# Altium project Longboard_32bit.PrjPCB (part 3 of 6)

## Sheet Misc_switches.SchDoc: RP2040 CNC
size B; Author: AM; CompanyName: Expatria Technologies; DrawnBy: A.Marles; Engineer: AM; Organization: Expatria Technolgoies; Address1: PO Box 2084; Address3: Merritt, BC V1K 1B8; Address4: Canada; DocumentNumber: 20; Revision: B6; SheetNumber: 17; SheetTotal: 26
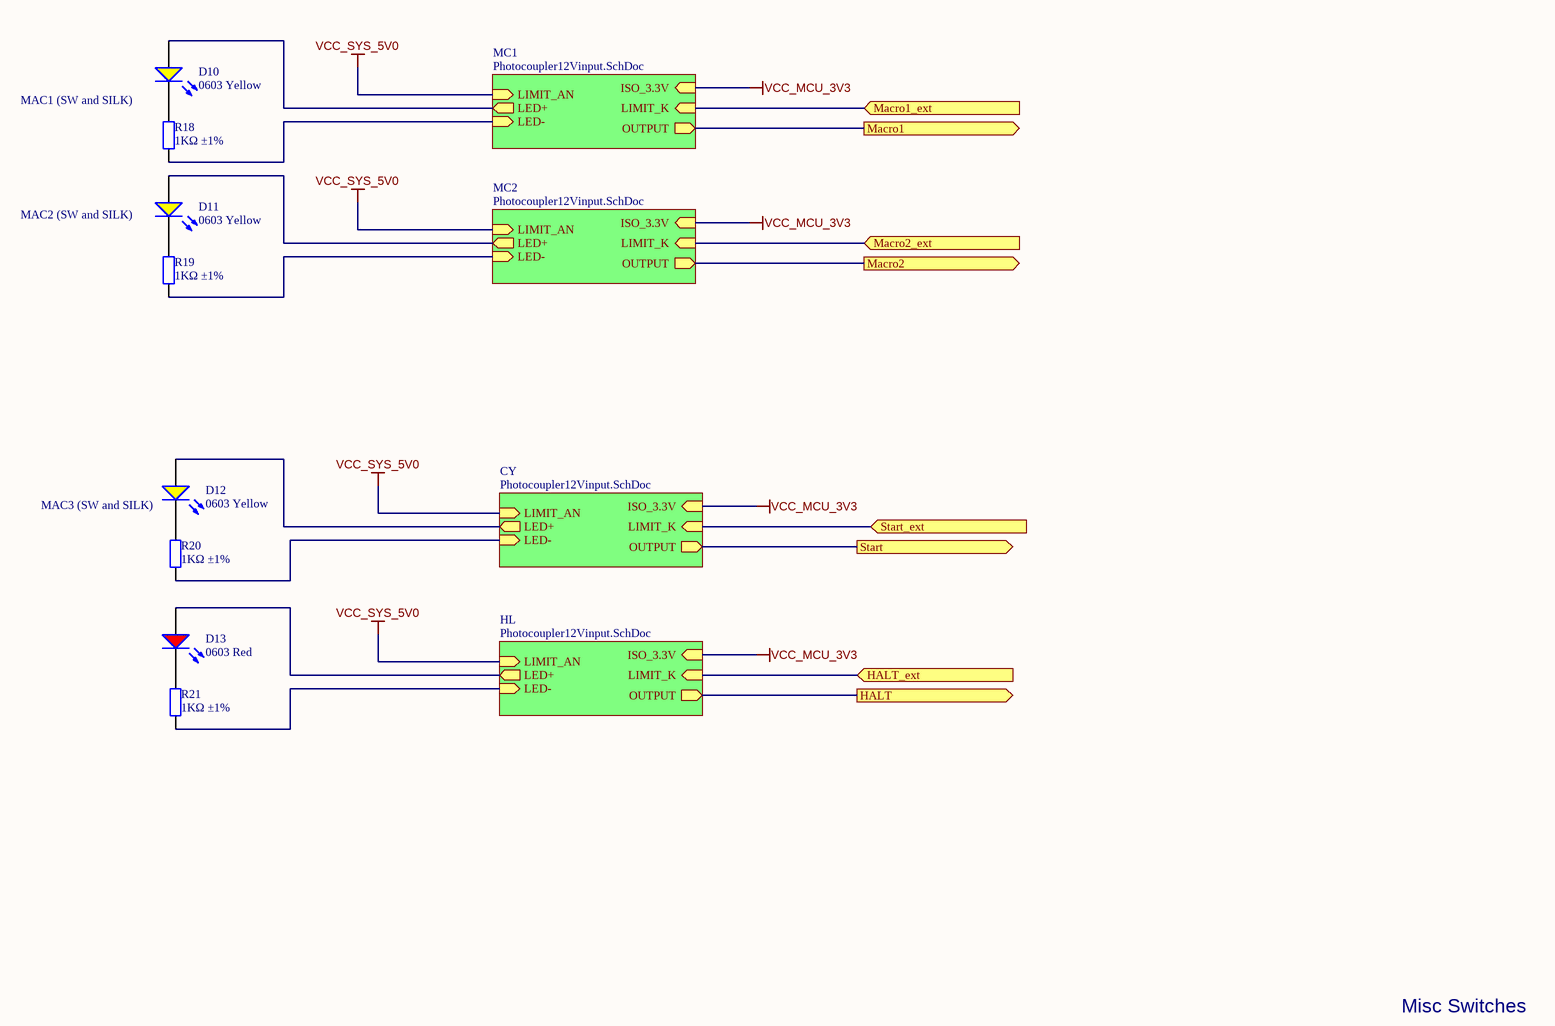
[diagram p8: Misc_switches.SchDoc]

### Parts
D10  0603 Yellow  [0603_LED_S1 - YELLOW]
D11  0603 Yellow  [0603_LED_S1 - YELLOW]
D12  0603 Yellow  [0603_LED_S1 - YELLOW]
D13  0603 Red  [0603_LED_S1]
R18  1KΩ ±1%  [0402_R]
R19  1KΩ ±1%  [0402_R]
R20  1KΩ ±1%  [0402_R]
R21  1KΩ ±1%  [0402_R]

### Sub-sheets
CY = Photocoupler12Vinput.SchDoc: OUTPUT (out), LED- (in), LED+ (out), ISO_3.3V (in), LIMIT_AN (in), LIMIT_K (in)
HL = Photocoupler12Vinput.SchDoc: OUTPUT (out), LED+ (out), LED- (in), ISO_3.3V (in), LIMIT_AN (in), LIMIT_K (in)
MC1 = Photocoupler12Vinput.SchDoc: OUTPUT (out), LED+ (out), LED- (in), ISO_3.3V (in), LIMIT_AN (in), LIMIT_K (in)
MC2 = Photocoupler12Vinput.SchDoc: OUTPUT (out), LED+ (out), LED- (in), ISO_3.3V (in), LIMIT_AN (in), LIMIT_K (in)

### Ports
HALT (out), HALT_ext (in), Macro1 (out), Macro1_ext (in), Macro2 (out), Macro2_ext (in), Start (out), Start_ext (in)

### Nets
VCC_MCU_3V3: D10.A D11.A D12.A D13.A ; sheet CY/LED+, sheet CY/ISO_3.3V, sheet MC1/LED+, sheet MC1/ISO_3.3V, sheet HL/LED+, sheet HL/ISO_3.3V, sheet MC2/LED+, sheet MC2/ISO_3.3V
VCC_SYS_5V0: sheet CY/LIMIT_AN, sheet MC1/LIMIT_AN, sheet HL/LIMIT_AN, sheet MC2/LIMIT_AN
CYC/ST: R20.2 ; port Start, sheet CY/OUTPUT, sheet CY/LED-
HALT: R21.2 ; port HALT, sheet HL/OUTPUT, sheet HL/LED-
HALT_ext: port HALT_ext, sheet HL/LIMIT_K
MAC1: R18.2 ; port Macro1, sheet MC1/OUTPUT, sheet MC1/LED-
MAC2: R19.2 ; port Macro2, sheet MC2/OUTPUT, sheet MC2/LED-
Macro1_ext: port Macro1_ext, sheet MC1/LIMIT_K
Macro2_ext: port Macro2_ext, sheet MC2/LIMIT_K
Start_ext: port Start_ext, sheet CY/LIMIT_K
NetD10_K: D10.K R18.1
NetD11_K: D11.K R19.1
NetD12_K: D12.K R20.1
NetD13_K: D13.K R21.1

### Notes on the sheet
- MAC1 (SW and SILK)
- MAC2 (SW and SILK)
- MAC3 (SW and SILK)
- Misc Switches
- SHEET
- Expatria Technologies
- 625 Kane Valley Rd.
- Box 2084
- Merritt, BC V1K1B8
- PROJECT
- SIZE
- ENGR
- MODIFIED
- DOCUMENT
- REV
- Copyright Sienci Labs 2024. This document describes Open Hardware and is licensed under the CERN-OHL-S v2. No warranty is implied or expressed.
- EMAIL: INFO@EXPATRIA.CA
- B
- /

### Library data of the parts
D10-D12 = 0603 LED Yellow: LED; ComponentLink1Description: 供应商链接; ComponentLink1URL: http://www.szlcsc.com/product/details_73147.html; Package: 0603; Supplier: LC; SuppliersPartNumber: C72038; Color: Yellow
D13 = 19-213SURC/S530-A3/TR8: 20mA 632nm Colorless transparence 624nm~624nm -40℃~+85℃ Red 120° 60mW 0603 Light Emitting Diodes (LED) ROHS; Manufacturer: Everlight Elec; ComponentLink1Description: 供应商链接; ComponentLink1URL: http://www.szlcsc.com/product/details_2659.html; Package: 0603; Supplier: LC; SuppliersPartNumber: C72039; Color: Red; Supplier 1: LC; Supplier Part Number 1: C72039; Manufacturer Part Number: 19-213SURC/S530-A3/TR8
R18-R21 = 0402 1K (1001) 1%: Chip resistor; Manufacturer: Uniroyal Elec; PartNumber: 0402WGF1001TCE; Power: 1/16W; ComponentLink1Description: Supplier link; ComponentLink1URL: http://www.szlcsc.com/product/details_12256.html; Package: 0402; Supplier: LC; SuppliersPartNumber: C11702; Resistance: 1KΩ; Tolerance: 1%; Manufacturer Part Number: 0402WGF1001TCE

## Sheet Spindle_Control.SchDoc: STM32F446 CNC
size B; Author: AM; CompanyName: Expatria Technologies; DrawnBy: A.Marles; Engineer: AM; Organization: Expatria Technolgoies; Address1: PO Box 2084; Address3: Merritt, BC V1K 1B8; Address4: Canada; DocumentNumber: 25; Revision: B6; SheetNumber: 22; SheetTotal: 26
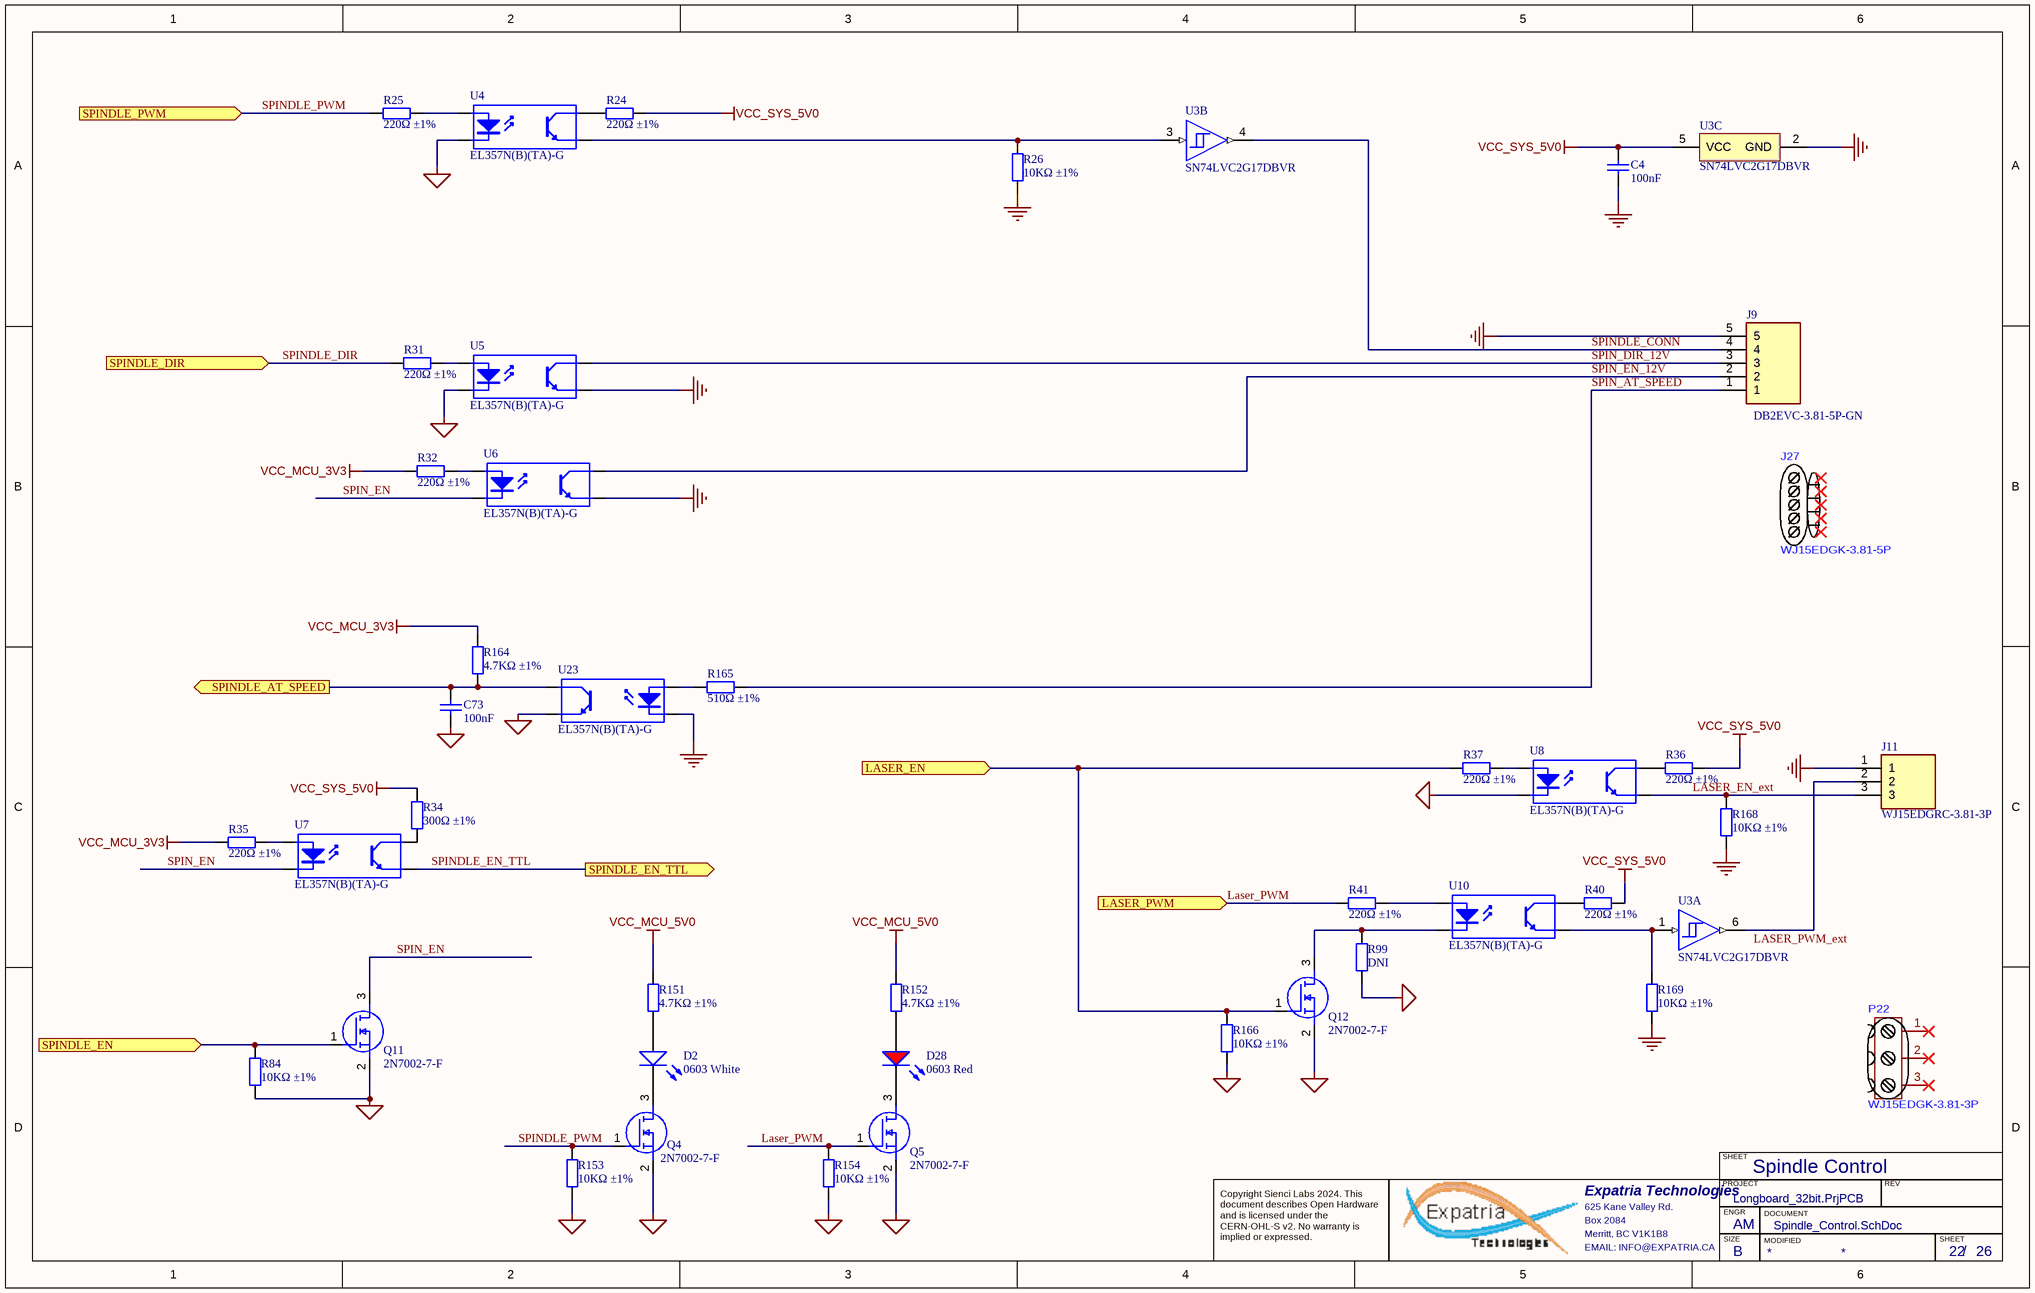
[diagram p9: Spindle_Control.SchDoc]

### Parts
C4  100nF  [0603_C]
C73  100nF  [0402_C]
D2  0603 White  [0603_LED_S1 - white]
D28  0603 Red  [0603_LED_S1]
J9  DB2EVC-3.81-5P-GN  [CONN-TH_5P-P3.81_DB2EVC-3.81-5P]
J11  WJ15EDGRC-3.81-3P  [SHDRRA3W85P0X381_1X3_1231X915X720P]
J27  WJ15EDGK-3.81-5P  (mechanical)
P22  WJ15EDGK-3.81-3P  (mechanical)
Q4  2N7002-7-F  [SOT-23(SOT-23-3)]
Q5  2N7002-7-F  [SOT-23(SOT-23-3)]
Q11  2N7002-7-F  [SOT-23(SOT-23-3)]
Q12  2N7002-7-F  [SOT-23(SOT-23-3)]
R24  220Ω ±1%  [0402_R]
R25  220Ω ±1%  [0402_R]
R26  10KΩ ±1%  [0402_R]
R31  220Ω ±1%  [0402_R]
R32  220Ω ±1%  [0402_R]
R34  300Ω ±1%  [0603_R]
R35  220Ω ±1%  [0402_R]
R36  220Ω ±1%  [0402_R]
R37  220Ω ±1%  [0402_R]
R40  220Ω ±1%  [0402_R]
R41  220Ω ±1%  [0402_R]
R84  10KΩ ±1%  [0402_R]
R99  DNI  [0603_R]
R151  4.7KΩ ±1%  [0402_R]
R152  4.7KΩ ±1%  [0402_R]
R153  10KΩ ±1%  [0402_R]
R154  10KΩ ±1%  [0402_R]
R164  4.7KΩ ±1%  [0402_R]
R165  510Ω ±1%  [0402_R]
R166  10KΩ ±1%  [0402_R]
R168  10KΩ ±1%  [0402_R]
R169  10KΩ ±1%  [0402_R]
U3  SN74LVC2G17DBVR  [DBV0006A_N]  (parts A,B,C of 3)
U4  EL357N(B)(TA)-G  [SOP-4_P2.54]
U5  EL357N(B)(TA)-G  [SOP-4_P2.54]
U6  EL357N(B)(TA)-G  [SOP-4_P2.54]
U7  EL357N(B)(TA)-G  [SOP-4_P2.54]
U8  EL357N(B)(TA)-G  [SOP-4_P2.54]
U10  EL357N(B)(TA)-G  [SOP-4_P2.54]
U23  EL357N(B)(TA)-G  [SOP-4_P2.54]

### Ports
LASER_EN (in), LASER_PWM (in), SPINDLE_AT_SPEED (out), SPINDLE_DIR (in), SPINDLE_EN (in), SPINDLE_EN_TTL (out), SPINDLE_PWM (in)

### Nets
GND: C4.1 J9.5 J11.1 R26.1 R168.1 R169.1 U3.2(GND) U5.3(E) U6.3(E) U23.2(K)
MCU_GND: C73.1 Q4.2(S) Q5.2(S) Q11.2(S) Q12.2(S) R84.1 R99.2 R153.1 R154.1 R166.1 U4.2(K) U5.2(K) U8.2(K) U23.3(E)
VCC_MCU_3V3: R32.1 R35.1 R164.1
VCC_MCU_5V0: R151.2 R152.2
VCC_SYS_5V0: C4.2 R24.2 R34.1 R36.2 R40.1 U3.5(VCC)
LASER_EN: Q12.1(G) R37.1 R166.2 ; port LASER_EN
LASER_EN_ext: J11.3 R168.2 U8.3(E)
Laser_PWM: Q5.1(G) R41.1 R154.2 ; port LASER_PWM
LASER_PWM_ext: J11.2 U3.6(1Y)
SPIN_AT_SPEED: J9.1 R165.1
SPIN_DIR_12V: J9.3 U5.4(C)
SPIN_EN: Q11.3(D) U6.2(K) U7.2(K)
SPIN_EN_12V: J9.2 U6.4(C)
SPINDLE_AT_SPEED: C73.2 R164.2 U23.4(C) ; port SPINDLE_AT_SPEED
SPINDLE_CONN: J9.4 U3.4(2Y)
SPINDLE_DIR: R31.1 ; port SPINDLE_DIR
SPINDLE_EN: Q11.1(G) R84.2 ; port SPINDLE_EN
SPINDLE_EN_TTL: U7.3(E) ; port SPINDLE_EN_TTL  [project net SPINDLE_EN_5V]
SPINDLE_PWM: Q4.1(G) R25.1 R153.2 ; port SPINDLE_PWM
NetD2_A: D2.A R151.1
NetD2_K: D2.K Q4.3(D)
NetD28_A: D28.A R152.1
NetD28_K: D28.K Q5.3(D)
NetQ12_3: Q12.3(D) R99.1 U10.2(K)
NetR24_1: R24.1 U4.4(C)
NetR25_2: R25.2 U4.1(A)
NetR26_2: R26.2 U3.3(2A) U4.3(E)
NetR31_2: R31.2 U5.1(A)
NetR32_2: R32.2 U6.1(A)
NetR34_2: R34.2 U7.4(C)
NetR35_2: R35.2 U7.1(A)
NetR36_1: R36.1 U8.4(C)
NetR37_2: R37.2 U8.1(A)
NetR40_2: R40.2 U10.4(C)
NetR41_2: R41.2 U10.1(A)
NetR165_2: R165.2 U23.1(A)
NetR169_2: R169.2 U3.1(1A) U10.3(E)

Not connected (* = marked no-connect by the designer): P22 1* 2* 3*

### Notes on the sheet
- Spindle Control
- SHEET
- Expatria Technologies
- 625 Kane Valley Rd.
- Box 2084
- Merritt, BC V1K1B8
- PROJECT
- SIZE
- ENGR
- MODIFIED
- DOCUMENT
- REV
- Copyright Sienci Labs 2024. This document describes Open Hardware and is licensed under the CERN-OHL-S v2. No warranty is implied or expressed.
- EMAIL: INFO@EXPATRIA.CA
- B
- /

### Library data of the parts
C4 = 0603 100nF (104) 10% 50V: 50V 100nF X7R ±10% 0603 Multilayer Ceramic Capacitors MLCC - SMD/SMT ROHS; Manufacturer: YAGEO; Manufacturer Part Number: CC0603KRX7R9BB104; ComponentLink1Description: Supplier link; ComponentLink1URL: http://www.szlcsc.com/product/details_15331.html; Package: 0603; Supplier: LC; SuppliersPartNumber: C14663; Capacitance: 100nF; Tolerance: 10%; Voltage: 50V
C73 = 0402 100nF (104) 10% 16V: 16V 100nF X7R ±10% 0402 Multilayer Ceramic Capacitors MLCC - SMD/SMT ROHS; Manufacturer: Samsung Electro-Mechanics; Manufacturer Part Number: CL05B104KO5NNNC; ComponentLink1Description: Supplier link; ComponentLink1URL: http://www.szlcsc.com/product/details_1877.html; Package: 0402; Supplier: LC; SuppliersPartNumber: C1525; Capacitance: 100nF; Tolerance: 10%; Voltage: 16V
D2 = 19-217UWD/S365-2/TR8: LED; Manufacturer: Everlight Elec; Package: 0603; Supplier: LC; SuppliersPartNumber: C133759; Color: White; Manufacturer Part Number: 19-217UWD/S365-2/TR8
D28 = 19-213SURC/S530-A3/TR8: as D13 on sheet Misc_switches; Package: 0603; Supplier: LC; SuppliersPartNumber: C72039; Color: Red; ComponentLink1Description: 供应商链接; ComponentLink1URL: http://www.szlcsc.com/product/details_2659.html; Supplier 1: LC; Supplier Part Number 1: C72039; Manufacturer Part Number: 19-213SURC/S530-A3/TR8
J9 = DB2EVC-3.81-5P-GN: 3.81mm Green Board Edge/Receptacle-Close Push-Pull,P=3.81mm Pluggable System Terminal Block ROHS; Manufacturer: DIBO; SuppliersPartNumber: C395701; Manufacturer Part Number: DB2EVC-3.81-5P-GN; Supplier: LCSC; Value: DB2EVC-3.81-5P-GN
J11 = WJ15EDGRC-3.81-3P: 3.81mm Green Board Edge/Receptacle-Close Push-Pull,P=3.81mm Pluggable System Terminal Block ROHS; Manufacturer: Ningbo Kangnex; SuppliersPartNumber: C8406; Datasheet Link: https://datasheet.lcsc.com/szlcsc/1912251633_Ningbo-Kangnex-Elec-WJ15EDGRC-3-81-3P_C8406.pdf; Height: 7.2mm; Manufacturer Part Number: WJ15EDGRC-3.81-3P
J27 = WJ15EDGK-3.81-5P: 3.81mm Green Plug P=3.81mm Pluggable System Terminal Block ROHS; Manufacturer: Ningbo Kangnex Elec; SuppliersPartNumber: C3804; Manufacturer Part Number: WJ15EDGK-3.81-5P; Supplier: LCSC
P22 = WJ15EDGK-3.81-3P: 3.81mm Green Plug P=3.81mm Pluggable System Terminal Block ROHS; Manufacturer: Ningbo; Value: WJ15EDGK-3.81-3P; SuppliersPartNumber: C8413; Supplier: LCSC; Manufacturer Part Number: WJ15EDGK-3.81-3P
Q4 Q5 Q11 Q12 = 2N7002-7-F: 60V 115mA 7.5Ω@5V,50mA 370mW N Channel SOT-23 MOSFETs ROHS; Manufacturer: Diodes Inc.; SuppliersPartNumber: C85049; Manufacturer Part Number: 2N7002-7-F; Value: 2N7002-7-F; Datasheet Link: https://datasheet.datasheetarchive.com/originals/distributors/SFDatasheet-0/sf-0003625.pdf; Height: 1.2mm; Manufacturer_Part_Number: 2N7002-7-F; Mouser Part Number: 621-2N7002-F; Mouser Price/Stock: https://www.mouser.co.uk/ProductDetail/Diodes-Incorporated/2N7002-7-F?qs=jMXWnm70%252BC%252BAX%252BMLzUkTZg%3D%3D; Arrow Part Number: 2N7002-7-F; Arrow Price/Stock: https://www.arrow.com/en/products/2n7002-7-f/diodes-incorporated?region=nac
R24 R25 R31 R32 R35-R37 R40 R41 = 0402 220R (2200) 1%: Chip resistor; Manufacturer: Uniroyal Elec; Manufacturer Part Number: 0402WGF2200TCE; Power: 1/16W; ComponentLink1Description: Supplier link; ComponentLink1URL: http://www.szlcsc.com/product/details_25834.html; Package: 0402; Supplier: LC; SuppliersPartNumber: C25091; Resistance: 220Ω; Tolerance: 1%
R26 R84 R153 R154 R166 R168 R169 = 0402 10K (1002) 1%: Chip resistor; Manufacturer: Uniroyal Elec; Manufacturer Part Number: 0402WGF1002TCE; Power: 1/16W; Package: 0402; Supplier: LC; SuppliersPartNumber: C25744; Resistance: 10KΩ; Tolerance: 1%; ComponentLink1Description: Supplier link; ComponentLink1URL: http://www.szlcsc.com/product/details_26487.html
R34 = 0603 300R (3000) 1%: Chip resistor; Manufacturer: Uniroyal Elec; Manufacturer Part Number: 0603WAF3000T5E; Power: 1/10W; Package: 0603; Supplier: LCSC; SuppliersPartNumber: C23025; Resistance: 300Ω; Tolerance: 1%; ComponentLink1Description: Supplier link; ComponentLink1URL: http://www.szlcsc.com/product/details_23752.html
R99 = 0603 0R (0R0) 1%: Chip resistor; Manufacturer: Uniroyal Elec; Manufacturer Part Number: 0603WAF0000T5E; Power: 1/10W; Resistance: 0Ω; Tolerance: 1%; ComponentLink1Description: Supplier link; ComponentLink1URL: http://www.szlcsc.com/product/details_21903.html; Package: 0603; Supplier: LC; SuppliersPartNumber: C21189
R151 R152 = 0402 4.7K (4701) 1%: Chip resistor; Manufacturer: Uniroyal Elec; Manufacturer Part Number: 0402WGF4701TCE; Power: 1/16W; ComponentLink1Description: Supplier link; ComponentLink1URL: http://www.szlcsc.com/product/details_26643.html; Package: 0402; Supplier: LCSC; SuppliersPartNumber: C25900; Resistance: 4.7KΩ; Tolerance: 1%
R164 = 0402 4.7K (4701) 1%: Chip resistor; Manufacturer: Uniroyal Elec; PartNumber: 0402WGF4701TCE; Power: 1/16W; Package: 0402; Supplier: LC; SuppliersPartNumber: C25900; Resistance: 4.7KΩ; Tolerance: 1%; ComponentLink1Description: Supplier link; ComponentLink1URL: http://www.szlcsc.com/product/details_26643.html
R165 = 0402 510R (5100) 1%: Chip resistor; Manufacturer: Uniroyal Elec; Manufacturer Part Number: 0402WGF5100TCE; Power: 1/16W; ComponentLink1Description: Supplier link; ComponentLink1URL: http://www.szlcsc.com/product/details_25866.html; Package: 0402; Supplier: LC; SuppliersPartNumber: C25123; Resistance: 510Ω; Tolerance: 1%
U3 = CMP-0859-00225-4: Dual Schmitt-Trigger Buffer, DBV0006A, LARGE T&R; Manufacturer: Texas Instruments; F @ Nom Voltage(Max)(Mhz): 150; VCC(Max)(V): 5.5; tpd @ Nom Voltage(Max)(ns): 9.3,5.7,5.4,4.3; Sub-Family: Non-Inverting Buffer/Driver; Output Drive (IOL/IOH)(Max)(mA): 32/-32; Output Type: CMOS; Voltage(Nom)(V): 1.8,2.5,3.3,5; ICC @ Nom Voltage(Max)(mA): 0.01; Schmitt Trigger: Yes; Technology Family: LVC; VCC(Min)(V): 1.65; 3-State Output: No; Rating: Catalog; Bits(#): 2; Input Type: CMOS/TTL; Logic: True; DatasheetVersion: SCES381N; Generic Part Number: SN74LVC2G17; PackageReference: DBV0006A; Operating Temperature Range(C): -40 to 125,-40 to 85; SuppliersPartNumber: C10429; Value: SN74LVC2G17DBVR; Manufacturer Part Number: SN74LVC2G17DBVR
U4-U8 U10 U23 = EL357N(B)(TA)-G_[C6649]: 80V 3750V 50mA 0.1V@1mA,20mA 1 6V 1.2V DC SOP-4-2.54mm Optocouplers - Phototransistor Output ROHS; Manufacturer 1: Everlight Elec; Package: SOP-4_P2.54; Supplier: LCSC; SuppliersPartNumber: C6649; Manufacturer Part Number 1: EL357N(B)(TA)-G; Manufacturer: Everlight Elec; Manufacturer Part Number: EL357N(B)(TA)-G
  U7 U8 U10 U23: ComponentLink1Description: 供应商链接; ComponentLink1URL: http://www.szlcsc.com/product/details_7114.html

## Sheet RS485.SchDoc: RP2040 CNC
size B; Author: AM; CompanyName: Expatria Technologies; DrawnBy: A.Marles; Engineer: AM; Organization: Expatria Technolgoies; Address1: PO Box 2084; Address3: Merritt, BC V1K 1B8; Address4: Canada; DocumentNumber: 29; Revision: B6; SheetNumber: 25; SheetTotal: 26
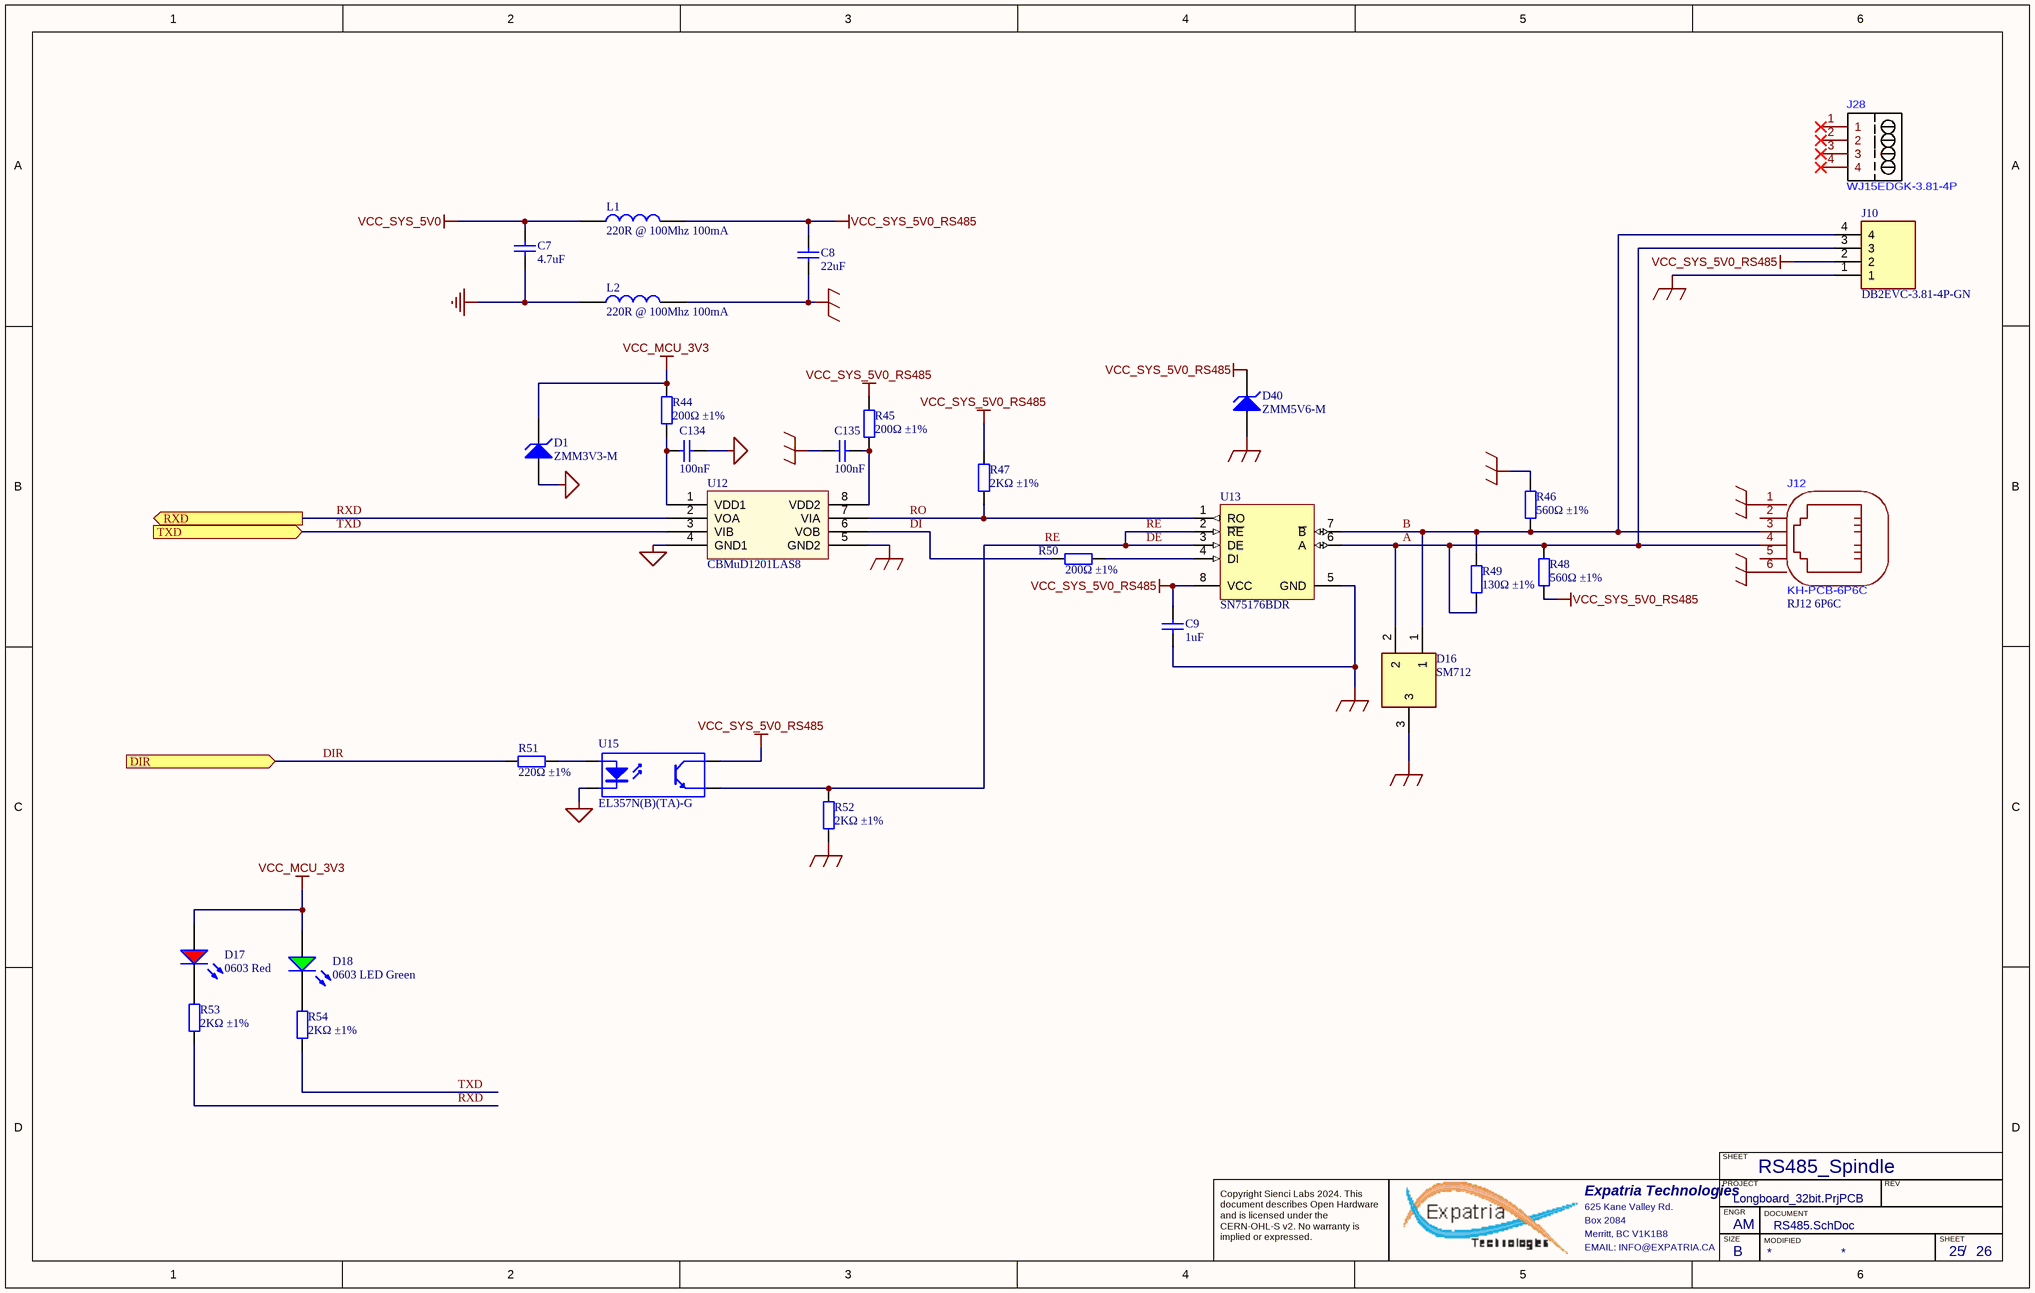
[diagram p10: RS485.SchDoc]

### Parts
C7  4.7uF  [0805_C]
C8  22uF  [0805_C]
C9  1uF  [0603_C]
C134  100nF  [0402_C]
C135  100nF  [0402_C]
D1  ZMM3V3-M  [LL-34]
D16  SM712  [SOT95P230X117-3N]
D17  0603 Red  [0603_LED_S1]
D18  0603 LED Green  [0603_LED_S1 - GREEN]
D40  ZMM5V6-M  [LL-34]
J10  DB2EVC-3.81-4P-GN  [CONN-TH_5P-P3.81_DB2EVC-3.81-4p]
J12  KH-PCB-6P6C  value RJ12 6P6C  [RJ11-TH_DS1133-S60BPX]
J28  WJ15EDGK-3.81-4P  (mechanical)
L1  220R @ 100Mhz 100mA  [0402_L]
L2  220R @ 100Mhz 100mA  [0402_L]
R44  200Ω ±1%  [0402_R]
R45  200Ω ±1%  [0402_R]
R46  560Ω ±1%  [0603_R]
R47  2KΩ ±1%  [0603_R]
R48  560Ω ±1%  [0603_R]
R49  130Ω ±1%  [0603_R]
R50  200Ω ±1%  [0402_R]
R51  220Ω ±1%  [0402_R]
R52  2KΩ ±1%  [0603_R]
R53  2KΩ ±1%  [0603_R]
R54  2KΩ ±1%  [0603_R]
U12  CBMuD1201LAS8  [SOIC-8_150mil]
U13  SN75176BDR  [SOIC-8_150mil]
U15  EL357N(B)(TA)-G  [SOP-4_P2.54]

### Ports
DIR (in), RXD (out), TXD (in)

### Nets
GND: C7.1 L2.1
MCU_GND: C134.2 D1.1(A) U12.4(GND1) U15.2(K)
MOD_GND: C8.1 C9.1 C135.1 D16.3 D40.1(A) J10.1 J12.1(MCLR) J12.6(NC) L2.2 R46.1 R52.1 U12.5(GND2) U13.5(GND)
VCC_MCU_3V3: D1.2(K) D17.A D18.A R44.2
VCC_SYS_5V0: C7.2 L1.1
VCC_SYS_5V0_RS485: C8.2 C9.2 D40.2(K) J10.2 L1.2 R45.2 R47.2 R48.2 U13.8(VCC) U15.4(C)
A: D16.2 J10.3 J12.4(PGD) R48.1 R49.1 U13.6(A)
B: D16.1 J10.4 J12.3(VSS) R46.2 R49.2 U13.7(~{B})
DE: R52.2 U13.2(~{RE}) U13.3(DE) U15.3(E)  [also labelled RE]
DI: R50.2 U12.6(VOB)
DIR: R51.2 ; port DIR
RO: R47.1 U12.7(VIA) U13.1(RO)
RXD: R53.1 U12.2(VOA) ; port RXD
TXD: R54.1 U12.3(VIB) ; port TXD
NetC134_1: C134.1 R44.1 U12.1(VDD1)
NetC135_2: C135.2 R45.1 U12.8(VDD2)
NetD17_K: D17.K R53.2
NetD18_K: D18.K R54.2
NetR50_1: R50.1 U13.4(DI)
NetR51_1: R51.1 U15.1(A)

Not connected (* = marked no-connect by the designer): J12 2(VDD) 5(PGC); J28 1* 2* 3* 4*

### Notes on the sheet
- RS485_Spindle
- SHEET
- Expatria Technologies
- 625 Kane Valley Rd.
- Box 2084
- Merritt, BC V1K1B8
- PROJECT
- SIZE
- ENGR
- MODIFIED
- DOCUMENT
- REV
- Copyright Sienci Labs 2024. This document describes Open Hardware and is licensed under the CERN-OHL-S v2. No warranty is implied or expressed.
- EMAIL: INFO@EXPATRIA.CA
- B
- /

### Library data of the parts
C7 = 0805 4.7uF (475) 10% 25V: Chip capacitors; Manufacturer: Samsung Electro-Mechanics; Manufacturer Part Number: CL21A475KAQNNNE; Tolerance: 10%; Voltage: 25V; ComponentLink1Description: Supplier link; ComponentLink1URL: http://www.szlcsc.com/product/details_2131.html; Package: 0805; Supplier: LCSC; SuppliersPartNumber: C1779; Capacitance: 4.7uF
C8 = 0805 22uF (226) 20% 25V: 25V 22uF X5R ±20% 0805 Multilayer Ceramic Capacitors MLCC - SMD/SMT ROHS; Manufacturer: Samsung Electro-Mechanics; Manufacturer Part Number: CL21A226MAQNNNE; ComponentLink1Description: Supplier link; ComponentLink1URL: http://www.szlcsc.com/product/details_46786.html; Package: 0805; Supplier: LC; SuppliersPartNumber: C45783; Capacitance: 22uF; Tolerance: 20%; Voltage: 25V
C9 = 0603 1uF (105) 10% 50V: Chip capacitors; Manufacturer: Samsung Electro-Mechanics; Manufacturer Part Number: CL10A105KB8NNNC; Tolerance: 10%; Voltage: 50V; ComponentLink1Description: Supplier link; ComponentLink1URL: http://www.szlcsc.com/product/details_16531.html; Package: 0603; Supplier: LCSC; SuppliersPartNumber: C15849; Capacitance: 1uF
C134 C135 = 0402 100nF (104) 10% 16V: as C73 on sheet Spindle_Control; ComponentLink1Description: Supplier link; ComponentLink1URL: http://www.szlcsc.com/product/details_1877.html; Package: 0402; Supplier: LC; SuppliersPartNumber: C1525; Capacitance: 100nF; Tolerance: 10%; Voltage: 16V
D1 = LL-34 ZMM3V3-M: Single 3.1V~3.5V 500mW 3.3V LL-34 Zener Diodes ROHS; Manufacturer: ST(Semtech); ComponentLink1Description: 供应商链接; ComponentLink1URL: http://www.szlcsc.com/product/details_8541.html; Package: LL-34; Supplier: LC; SuppliersPartNumber: C8056; Manufacturer Part Number: ZMM3V3-M
D16 = CDSOT23-SM712: Bidirectional 12V (Max), 7V (Max) 7.5V / 13.3V 10V / 20V 12A(8/20us) SOT-23-3 TVS RoHS; Manufacturer: DOWO; Height: 1.17mm; SuppliersPartNumber: C293966; Manufacturer Part Number: SM712; Supplier 1: LCSC; Supplier Part Number 1: C293966; Manufacturer 1: DOWO; Manufacturer Part Number 1: SM712; Package: SOT-23-3
D17 = 19-213SURC/S530-A3/TR8: as D13 on sheet Misc_switches; ComponentLink1Description: 供应商链接; ComponentLink1URL: http://www.szlcsc.com/product/details_2659.html; Package: 0603; Supplier: LC; SuppliersPartNumber: C72039; Color: Red; Supplier 1: LC; Supplier Part Number 1: C72039; Manufacturer Part Number: 19-213SURC/S530-A3/TR8
D18 = 19-217/GHC-YR1S2/3T: Colorless transparence -40℃~+85℃ 520nm~535nm Emerald 120° 110mW 0603 Light Emitting Diodes (LED) ROHS; Manufacturer: Everlight Elec; Package: 0603; Supplier: LC; SuppliersPartNumber: C72043; Color: Green; Manufacturer Part Number: 19-217/GHC-YR1S2/3T
D40 = LL-34 ZMM5V6-M: Single 5.2V~6V 500mW 5.6V LL-34 Zener Diodes ROHS; Manufacturer: ST(Semtech); ComponentLink1Description: 供应商链接; ComponentLink1URL: http://www.szlcsc.com/product/details_8541.html; Package: LL-34; Supplier: LC; SuppliersPartNumber: C8062; Manufacturer Part Number: ZMM5V6-M
J10 = DB2EVC-3.81-4P-GN: 3.81mm Green Board Edge/Receptacle-Close Push-Pull,P=3.81mm Pluggable System Terminal Block ROHS; Manufacturer: DIBO; SuppliersPartNumber: C395697; Manufacturer Part Number: DB2EVC-3.81-4P-GN; Supplier: LCSC; Value: DB2EVC-3.81-4P-GN
J12 = KH-PCB-6P6C: RJ45 RJReceptacle No 1 Shrouded Without LED -45℃~+85℃ Plugin Ethernet Connectors/Modular Connectors (RJ45 RJ11) ROHS; Manufacturer: Shenzhen Kinghelm Elec; Manufacturer Part Number: KH-PCB-6P6C; SuppliersPartNumber: C2683354; Supplier: LCSC
J28 = WJ15EDGK-3.81-4P: 3.81mm Green Plug P=3.81mm Pluggable System Terminal Block ROHS; Manufacturer: Ningbo; SuppliersPartNumber: C7244; Supplier: LCSC; Manufacturer Part Number: WJ15EDGK-3.81-4P; Value: WJ15EDGK-3.81-4P
L1 L2 = 0402 220R@100Mhz 0.1A: 700mΩ ±25% 220Ω@100MHz 0402 Ferrite Beads ROHS; Manufacturer Part Number: CBG100505U221T; Manufacturer: FH (Guangdong Fenghua Advanced Tech); Package: 0402; Supplier: LC; SuppliersPartNumber: C92617
R44 R45 R50 = 0402 200R (2000) 1%: Chip resistor; Manufacturer: Uniroyal Elec; Manufacturer Part Number: 0402WGF2000TCE; Power: 1/16W; ComponentLink1Description: Supplier link; ComponentLink1URL: http://www.szlcsc.com/product/details_25830.html; Package: 0402; Supplier: LC; SuppliersPartNumber: C25087; Resistance: 200Ω; Tolerance: 1%
R46 R48 = 0603 560R (5600) 1%: Chip resistor; Manufacturer: Uniroyal Elec; Manufacturer Part Number: 0603WAF5600T5E; Power: 1/10W; ComponentLink1Description: Supplier link; ComponentLink1URL: http://www.szlcsc.com/product/details_23931.html; Package: 0603; Supplier: LCSC; SuppliersPartNumber: C23204; Resistance: 560Ω; Tolerance: 1%
R47 R52-R54 = 0603 2K (2001) 1%: Chip resistor; Manufacturer: Uniroyal Elec; Manufacturer Part Number: 0603WAF2001T5E; Power: 1/10W; ComponentLink1Description: Supplier link; ComponentLink1URL: http://www.szlcsc.com/product/details_23702.html; Package: 0603; Supplier: LCSC; SuppliersPartNumber: C22975; Resistance: 2KΩ; Tolerance: 1%
R49 = 0603 130R (1300) 1%: Chip resistor; Manufacturer: Uniroyal Elec; Manufacturer Part Number: 0603WAF1300T5E; Power: 1/10W; ComponentLink1Description: Supplier link; ComponentLink1URL: http://www.szlcsc.com/product/details_23523.html; Package: 0603; Supplier: LCSC; SuppliersPartNumber: C22796; Resistance: 130Ω; Tolerance: 1%
R51 = 0402 220R (2200) 1%: as R24 on sheet Spindle_Control; Package: 0402; Supplier: LC; SuppliersPartNumber: C25091; Resistance: 220Ω; Tolerance: 1%; ComponentLink1Description: Supplier link; ComponentLink1URL: http://www.szlcsc.com/product/details_25834.html
U12 = CBMuD1201LAS8: Dual Channel Isolator; Manufacturer: Corebai Microelectronics; Package: SOIC-8_150mil; Supplier: LC; SuppliersPartNumber: C476472; ComponentLink1Description: 供应商链接; ComponentLink1URL: http://www.szlcsc.com/product/details_10199.html; Manufacturer Part Number: CBMuD1201LAS8
U13 = SN75176BDR_[C7063]: RS-485/RS-422; Manufacturer: Texas Instruments; ComponentLink1Description: 供应商链接; ComponentLink1URL: http://www.szlcsc.com/product/details_7535.html; Package: SOIC-8_150mil; Supplier: LCSC; SuppliersPartNumber: C7063; Manufacturer Part Number: SN75176BDR
U15 = EL357N(B)(TA)-G_[C6649]: 80V 3750V 50mA 0.1V@1mA,20mA 1 6V 1.2V DC SOP-4-2.54mm Optocouplers - Phototransistor Output ROHS; Manufacturer 1: Everlight; Manufacturer: Everlight Elec; Package: SOP-4_P2.54; Supplier: LCSC; SuppliersPartNumber: C6649; Manufacturer Part Number 1: EL357N(B)(TA)-G; Manufacturer Part Number: EL357N(B)(TA)-G

## Sheet Ethernet_Interface.SchDoc: STM32F446 CNC
size B; Author: AM; CompanyName: Expatria Technologies; DrawnBy: A.Marles; Engineer: AM; Organization: Expatria Technolgoies; Address1: PO Box 2084; Address3: Merritt, BC V1K 1B8; Address4: Canada; DocumentNumber: 7; Revision: B6; SheetNumber: 7; SheetTotal: 26
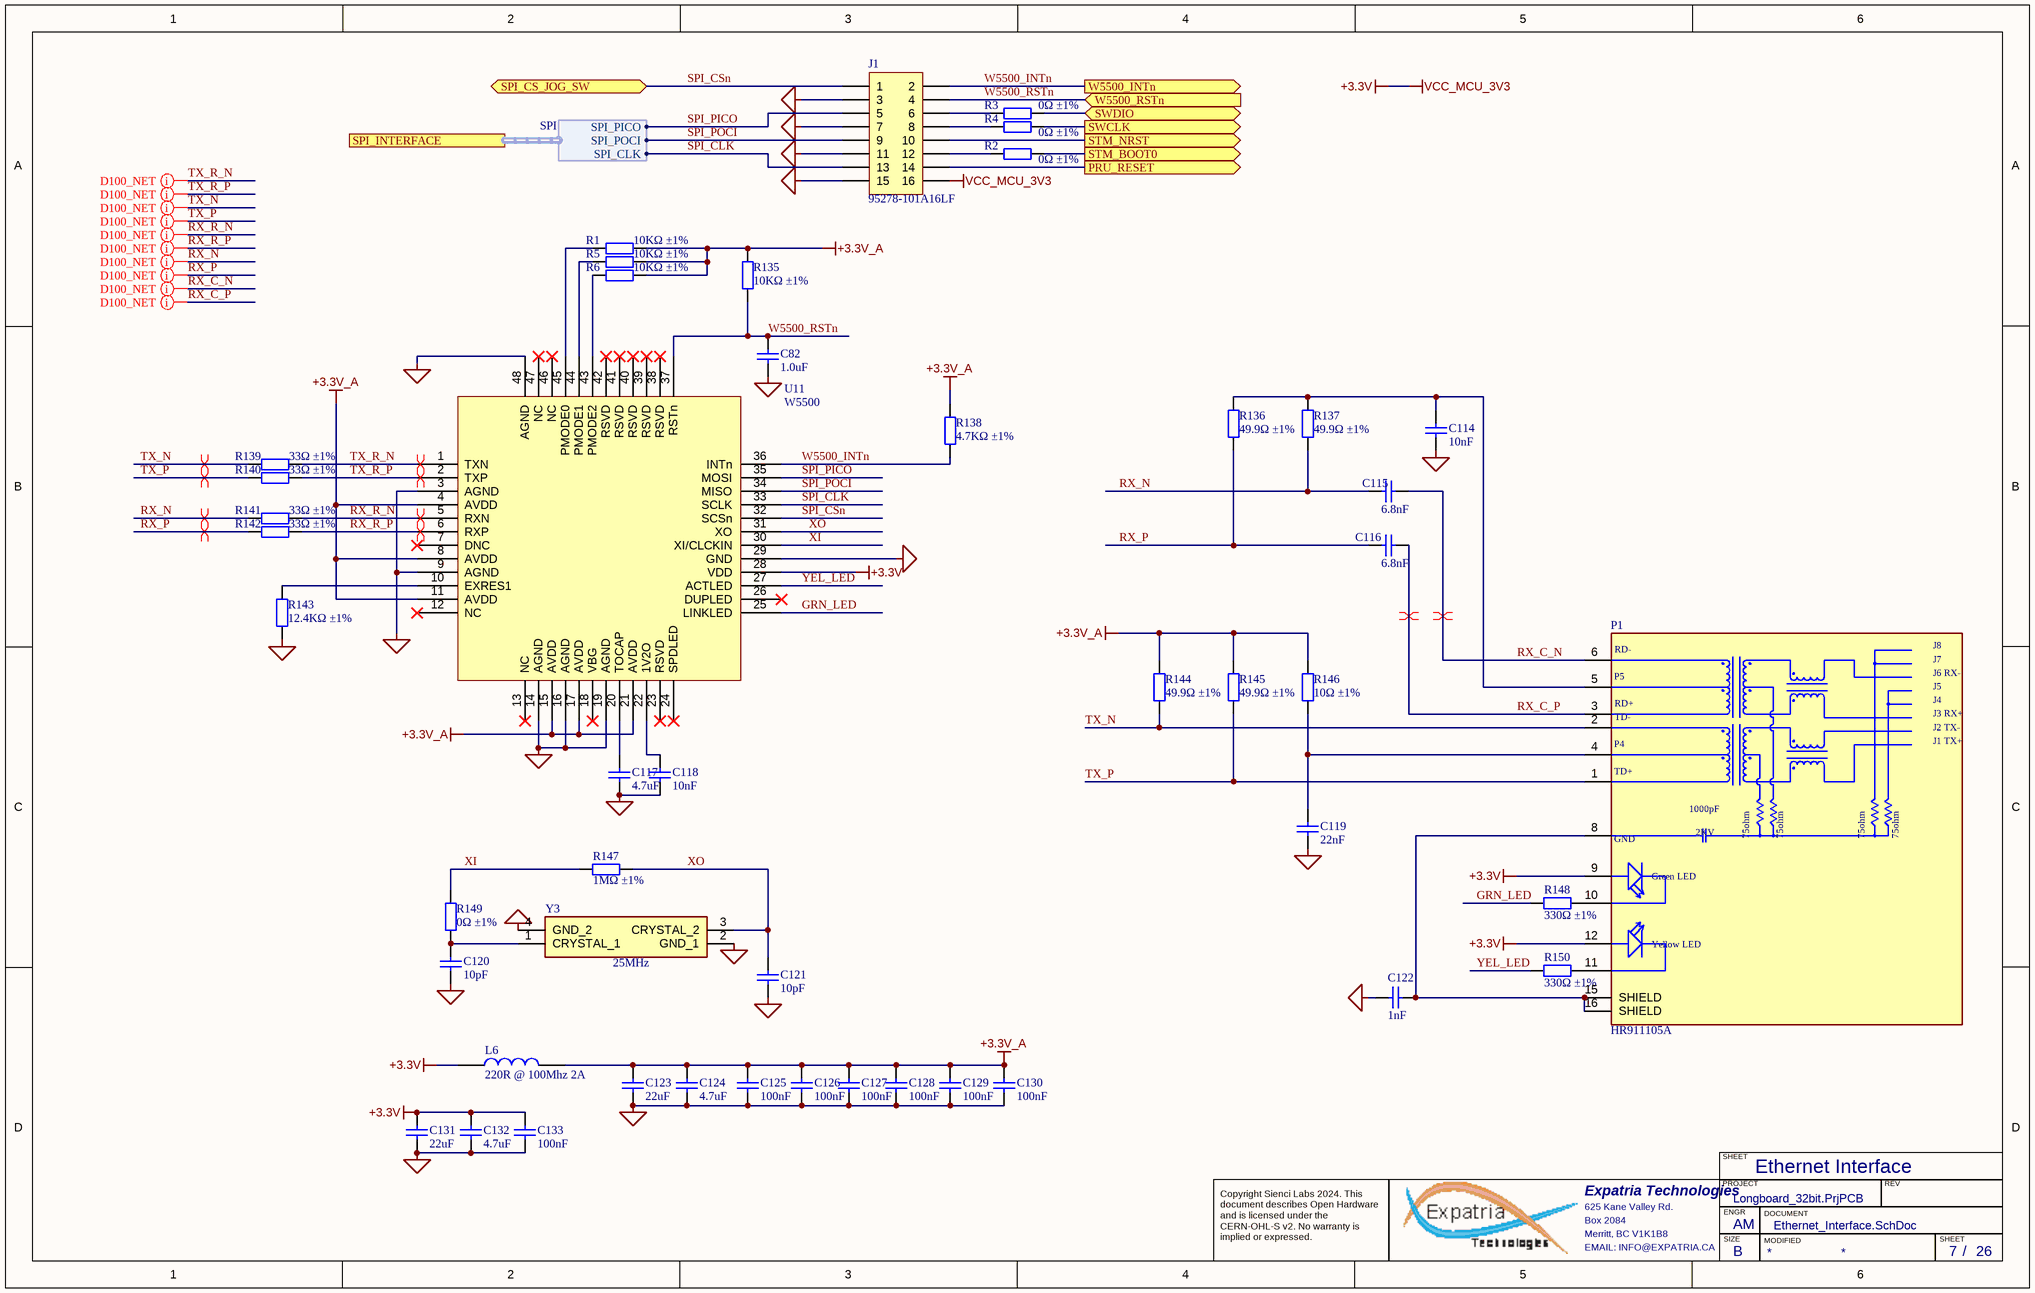
[diagram p11: Ethernet_Interface.SchDoc]

### Parts
C82  1.0uF  [0402_C]
C114  10nF  [0402_C]
C115  6.8nF  [0402_C]
C116  6.8nF  [0402_C]
C117  4.7uF  [0402_C]
C118  10nF  [0402_C]
C119  22nF  [0402_C]
C120  10pF  [0402_C]
C121  10pF  [0402_C]
C122  1nF  [1206_C]
C123  22uF  [0805_C]
C124  4.7uF  [0603_C]
C125  100nF  [0402_C]
C126  100nF  [0402_C]
C127  100nF  [0402_C]
C128  100nF  [0402_C]
C129  100nF  [0402_C]
C130  100nF  [0402_C]
C131  22uF  [0805_C]
C132  4.7uF  [0603_C]
C133  100nF  [0402_C]
J1  95278-101A16LF  [95278101A16LF]
L6  220R @ 100Mhz 2A  [0805_R]
P1  HR911105A  [HANRUN_HR911105A]
R1  10KΩ ±1%  [0402_R]
R2  0Ω ±1%  [0603_R]
R3  0Ω ±1%  [0603_R]
R4  0Ω ±1%  [0603_R]
R5  10KΩ ±1%  [0402_R]
R6  10KΩ ±1%  [0402_R]
R135  10KΩ ±1%  [0402_R]
R136  49.9Ω ±1%  [0402_R]
R137  49.9Ω ±1%  [0402_R]
R138  4.7KΩ ±1%  [0402_R]
R139  33Ω ±1%  [0402_R]
R140  33Ω ±1%  [0402_R]
R141  33Ω ±1%  [0402_R]
R142  33Ω ±1%  [0402_R]
R143  12.4KΩ ±1%  [0603_R]
R144  49.9Ω ±1%  [0402_R]
R145  49.9Ω ±1%  [0402_R]
R146  10Ω ±1%  [0402_R]
R147  1MΩ ±1%  [0402_R]
R148  330Ω ±1%  [0402_R]
R149  0Ω ±1%  [0402_R]
R150  330Ω ±1%  [0402_R]
U11  W5500  [LQFP-48_7x7x05P]
Y3  value 25MHz  [YSX321SL]  (hidden comment: X322525MSB4SI)

### Ports
PRU_RESET (out), SPI_CS_JOG_SW (bidir), SPI_INTERFACE (harness SPI), STM_BOOT0 (out), STM_NRST (out), SWCLK (out), SWDIO (bidir), W5500_INTn (out), W5500_RSTn (in)

### Harnesses
SPI: SPI_CLK, SPI_PICO, SPI_POCI

### Nets
+3.3V_A: C123.2 C124.2 C125.2 C126.2 C127.2 C128.2 C129.2 C130.2 L6.2 R1.1 R5.1 R6.1 R135.1 R138.1 R144.1 R145.1 R146.1 U11.4(AVDD) U11.8(AVDD) U11.11(AVDD) U11.15(AVDD) U11.17(AVDD) U11.21(AVDD)
MCU_GND: C82.1 C114.1 C117.1 C118.1 C119.1 C120.1 C121.1 C122.1 C123.1 C124.1 C125.1 C126.1 C127.1 C128.1 C129.1 C130.1 C131.1 C132.1 C133.1 J1.3 J1.7 J1.11 J1.15 R143.1 U11.3(AGND) U11.9(AGND) U11.14(AGND) U11.16(AGND) U11.19(AGND) U11.29(GND) U11.48(AGND) Y3.2(GND_1) Y3.4(GND_2)
VCC_MCU_3V3: C131.2 C132.2 C133.2 J1.16 L6.1 P1.9(GA) P1.12(YA) U11.28(VDD)  [also labelled +3.3V]
GRN_LED: R148.1 U11.25(LINKLED)
PRU_RESET: J1.14 ; port PRU_RESET
RX_C_N: C115.1 P1.6(RD-)
RX_C_P: C116.1 P1.3(RD+)
RX_N: C115.2 R137.2 R141.1
RX_P: C116.2 R136.2 R142.1
RX_R_N: R141.2 U11.5(RXN)
RX_R_P: R142.2 U11.6(RXP)
SPI_CLK: J1.13 U11.33(SCLK) ; port SPI_INTERFACE.SPI_CLK  [project net SBC_SPI_CLK]
SPI_CSn: J1.1 U11.32(SCSn) ; port SPI_CS_JOG_SW  [project net SPI_CS_JOG_SW]
SPI_PICO: J1.5 U11.35(MOSI) ; port SPI_INTERFACE.SPI_PICO  [project net SBC_SPI_PICO]
SPI_POCI: J1.9 U11.34(MISO) ; port SPI_INTERFACE.SPI_POCI  [project net SBC_SPI_POCI]
STM_BOOT0: R2.1 ; port STM_BOOT0
STM_RESET: J1.10 ; port STM_NRST
SWCLK: R4.1 ; port SWCLK
SWDIO: R3.1 ; port SWDIO
TX_N: P1.2(TD-) R139.1 R144.2
TX_P: P1.1(TD+) R140.1 R145.2
TX_R_N: R139.2 U11.1(TXN)
TX_R_P: R140.2 U11.2(TXP)
W5500_INTn: J1.2 R138.2 U11.36(INTn) ; port W5500_INTn  [project net RXD_INT]
W5500_RSTn: C82.2 J1.4 R135.2 U11.37(RSTn) ; port W5500_RSTn  [project net TXD_INT]
XI: R147.1 R149.1 U11.30(XI/CLCKIN)
XO: C121.2 R147.2 U11.31(XO) Y3.3(CRYSTAL_2)
YEL_LED: R150.1 U11.27(ACTLED)
NetC114_2: C114.2 P1.5(P5) R136.1 R137.1
NetC117_2: C117.2 U11.20(TOCAP)
NetC118_2: C118.2 U11.22(1V2O)
NetC119_2: C119.2 P1.4(P4) R146.2
NetC120_2: C120.2 R149.2 Y3.1(CRYSTAL_1)
NetC122_2: C122.2 P1.8(GND) P1.15(SHIELD) P1.16(SHIELD)
NetJ1_6: J1.6 R3.2
NetJ1_8: J1.8 R4.2
NetJ1_12: J1.12 R2.2
NetP1_10: P1.10(GC) R148.2
NetP1_11: P1.11(YC) R150.2
NetR1_2: R1.2 U11.45(PMODE0)
NetR5_2: R5.2 U11.44(PMODE1)
NetR6_2: R6.2 U11.43(PMODE2)
NetR143_2: R143.2 U11.10(EXRES1)

Not connected (* = marked no-connect by the designer): U11 7(DNC)* 12(NC)* 13(NC)* 18(VBG)* 23(RSVD)* 24(SPDLED)* 26(DUPLED)* 38(RSVD)* 39(RSVD)* 40(RSVD)* 41(RSVD)* 42(RSVD)* 46(NC)* 47(NC)*

### Layout directives
differential pair: RX_C_N, RX_C_P, RX_N, RX_P, RX_R_N, RX_R_P, TX_N, TX_P, TX_R_N, TX_R_P
net class D100_NET: RX_C_N, RX_C_P, RX_N, RX_P, RX_R_N, RX_R_P, TX_N, TX_P, TX_R_N, TX_R_P

### Notes on the sheet
- Ethernet Interface
- SHEET
- Expatria Technologies
- 625 Kane Valley Rd.
- Box 2084
- Merritt, BC V1K1B8
- PROJECT
- SIZE
- ENGR
- MODIFIED
- DOCUMENT
- REV
- Copyright Sienci Labs 2024. This document describes Open Hardware and is licensed under the CERN-OHL-S v2. No warranty is implied or expressed.
- EMAIL: INFO@EXPATRIA.CA
- B
- /
- (in symbol HR911105A) J8; J7; J6 RX-; J5; J4; J3 RX+; J2 TX-; J1 TX+; 1000pF; 2KV; 75ohm; Green LED; Yellow LED

### Library data of the parts
C82 = 0402 1.0uF (105) 10% 25V: Chip capacitor; Manufacturer: Samsung Electro-Mechanics; Manufacturer Part Number: CL05A105KA5NQNC; Capacitance: 1uF; Tolerance: 10%; Voltage: 25V; ComponentLink1Description: Supplier link; ComponentLink1URL: http://www.szlcsc.com/product/details_53938.html; Package: 0402; Supplier: LC; SuppliersPartNumber: C52923
C114 C118 = 0402 10nF (103) 10% 50V: Chip capacitors; Manufacturer: Samsung Electro-Mechanics; Manufacturer Part Number: CL05B103KB5NNNC; Tolerance: 10%; Voltage: 50V; ComponentLink1Description: Supplier link; ComponentLink1URL: http://www.szlcsc.com/product/details_15869.html; Package: 0402; Supplier: LC; SuppliersPartNumber: C15195; Capacitance: 10nF
C115 C116 = 0402 6.8nF (682) 10% 50V: Chip capacitors; Manufacturer: Guangdong Fenghua Advanced Tech; Manufacturer Part Number: 0402B682K500NT; Tolerance: 10%; Voltage: 50V; ComponentLink1Description: Supplier link; ComponentLink1URL: http://www.szlcsc.com/product/details_1894.html; Package: 0402; Supplier: LC; SuppliersPartNumber: C1542; Capacitance: 6.8nF
C117 = 0402 4.7uF (475) 20% 10V: Chip capacitor; Manufacturer: Samsung Electro-Mechanics; Manufacturer Part Number: CL05A475MP5NRNC; Tolerance: 20%; Voltage: 10V; ComponentLink1Description: Supplier link; ComponentLink1URL: http://www.szlcsc.com/product/details_24469.html; Package: 0402; Supplier: LC; SuppliersPartNumber: C23733; Capacitance: 4.7uF
C119 = 0402 22nF (223) 10% 50V: Chip capacitors; Manufacturer: Guangdong Fenghua Advanced Tech; Manufacturer Part Number: 0402B223K500NT; Tolerance: 10%; Voltage: 50V; ComponentLink1Description: Supplier link; ComponentLink1URL: http://www.szlcsc.com/product/details_1884.html; Package: 0402; Supplier: LC; SuppliersPartNumber: C1532; Capacitance: 22nF
C120 C121 = 0402 10pF (100) 5% 50V: Chip capacitors; Manufacturer: Samsung Electro-Mechanics; Manufacturer Part Number: CL05C100JB5NNNC; Tolerance: 5%; Voltage: 50V; ComponentLink1Description: Supplier link; ComponentLink1URL: http://www.szlcsc.com/product/details_33914.html; Package: 0402; Supplier: LC; SuppliersPartNumber: C32949; Capacitance: 10pF
C122 = 1206 1nF (102) 10% 500V: Chip capacitors; Manufacturer: Samsung Electro-Mechanics; Manufacturer Part Number: CL31B102KGFNNNE; Tolerance: 10%; Voltage: 500V; ComponentLink1Description: Supplier link; ComponentLink1URL: http://www.szlcsc.com/product/details_36187.html; Package: 1206; Supplier: LC; SuppliersPartNumber: C35216; Capacitance: 1nF
C123 C131 = 0805 22uF (226) 20% 25V: as C8 on sheet RS485; ComponentLink1Description: Supplier link; ComponentLink1URL: http://www.szlcsc.com/product/details_46786.html; Package: 0805; Supplier: LC; SuppliersPartNumber: C45783; Capacitance: 22uF; Tolerance: 20%; Voltage: 25V
C124 C132 = 0603 4.7uF (475) 10% 16V: 16V 4.7uF X5R ±10% 0603 Multilayer Ceramic Capacitors MLCC - SMD/SMT ROHS; Manufacturer: Samsung Electro-Mechanics; Manufacturer Part Number: CL10A475KO8NNNC; ComponentLink1Description: Supplier link; ComponentLink1URL: http://www.szlcsc.com/product/details_20375.html; Package: 0603; Supplier: LC; SuppliersPartNumber: C19666; Capacitance: 4.7uF; Tolerance: 10%; Voltage: 16V
C125-C130 C133 = 0402 100nF (104) 10% 16V: as C73 on sheet Spindle_Control; ComponentLink1Description: Supplier link; ComponentLink1URL: http://www.szlcsc.com/product/details_1877.html; Package: 0402; Supplier: LC; SuppliersPartNumber: C1525; Capacitance: 100nF; Tolerance: 10%; Voltage: 16V
J1 = 95278-101A16LF: Conn Unshrouded Header HDR 16 POS 2.54mm Solder ST Top Entry SMD BergStik® T/R; Manufacturer: Amphenol ICC / FCI; Supplier 1: LCSC; Manufacturer Part Number: 95278-101A16LF; RoHS: No; Category: Headers and Wire Housings; ComponentLink1URL: https://datasheet.ciiva.com/46395/95278-46395817.pdf?src-supplier=Element14; ComponentLink1Description: https://datasheet.ciiva.com/46395/95278-46395817.pdf?src-supplier=Element14; SuppliersPartNumber: C188235; Supplier: LCSC; Supplier Part Number 1: C188235; Value: 95278-101A16LF
L6 = CBW201209U221T: 150mΩ ±25% 220Ω@100MHz 0805 Ferrite Beads ROHS; Manufacturer: FH (Guangdong Fenghua Advanced Tech); Package: 0402; Supplier: LC; SuppliersPartNumber: C139188; Manufacturer Part Number: CBW201209U221T
P1 = HR911105A: HR911105A Ethernet Interface Arduino Platform Evaluation Expansion Board; Manufacturer: DFRobot; SuppliersPartNumber: C163507; Value: HR911105A; Manufacturer Part Number: HR911105A
R1 R5 R6 R135 = 0402 10K (1002) 1%: as R26 on sheet Spindle_Control; ComponentLink1Description: Supplier link; ComponentLink1URL: http://www.szlcsc.com/product/details_26487.html; Package: 0402; Supplier: LC; SuppliersPartNumber: C25744; Resistance: 10KΩ; Tolerance: 1%
R2-R4 = 0603 0R (0R0) 1%: Chip resistor; Manufacturer: Uniroyal Elec; Manufacturer Part Number: 0603WAF0000T5E; Power: 1/10W; ComponentLink1Description: Supplier link; ComponentLink1URL: http://www.szlcsc.com/product/details_21903.html; Package: 0603; Supplier: LCSC; SuppliersPartNumber: C21189; Resistance: 0Ω; Tolerance: 1%
R136 R137 R144 R145 = 0402 49.9R (49R9) 1%: Chip resistor; Manufacturer: Uniroyal Elec; Manufacturer Part Number: 0402WGF499JTCE; Power: 1/16W; ComponentLink1Description: Supplier link; ComponentLink1URL: http://www.szlcsc.com/product/details_25863.html; Package: 0402; Supplier: LC; SuppliersPartNumber: C25120; Resistance: 49.9Ω; Tolerance: 1%
R138 = 0402 4.7K (4701) 1%: as R151 on sheet Spindle_Control; ComponentLink1Description: Supplier link; ComponentLink1URL: http://www.szlcsc.com/product/details_26643.html; Package: 0402; Supplier: LC; SuppliersPartNumber: C25900; Resistance: 4.7KΩ; Tolerance: 1%
R139-R142 = 0402 33R (33R0) 1%: Chip resistor; Manufacturer: Uniroyal Elec; Manufacturer Part Number: 0402WGF330JTCE; Power: 1/16W; ComponentLink1Description: Supplier link; ComponentLink1URL: http://www.szlcsc.com/product/details_25848.html; Package: 0402; Supplier: LC; SuppliersPartNumber: C25105; Resistance: 33Ω; Tolerance: 1%
R143 = 0603 10K (1002) 1%: Chip resistor; Manufacturer: Uniroyal Elec; Manufacturer Part Number: 0603WAF1242T5E; Power: 1/10W; Resistance: 12.4K; ComponentLink1Description: Supplier link; ComponentLink1URL: http://www.szlcsc.com/product/details_26547.html; Package: 0603; Supplier: LC; SuppliersPartNumber: C22865; Tolerance: 1%
R146 = 0402 10R (10R0) 1%: Chip resistor; Manufacturer: Uniroyal Elec; Manufacturer Part Number: 0402WGF100JTCE; Power: 1/16W; ComponentLink1Description: Supplier link; ComponentLink1URL: http://www.szlcsc.com/product/details_25820.html; Package: 0402; Supplier: LC; SuppliersPartNumber: C25077; Resistance: 10Ω; Tolerance: 1%
R147 = 0402 1M (1004) 1%: Chip resistor; Manufacturer: Uniroyal Elec; Manufacturer Part Number: 0402WGF1004TCE; Power: 1/16W; ComponentLink1Description: Supplier link; ComponentLink1URL: http://www.szlcsc.com/product/details_26826.html; Package: 0402; Supplier: LC; SuppliersPartNumber: C26083; Resistance: 1MΩ; Tolerance: 1%
R148 R150 = 0402 330R (3300) 1%: Chip resistor; Manufacturer: Uniroyal Elec; Manufacturer Part Number: 0402WGF3300TCE; Power: 1/16W; ComponentLink1Description: Supplier link; ComponentLink1URL: http://www.szlcsc.com/product/details_25847.html; Package: 0402; Supplier: LC; SuppliersPartNumber: C25104; Resistance: 330Ω; Tolerance: 1%
R149 = 0402 0R (0R0) 1%: Chip resistor; Manufacturer: Uniroyal Elec; Manufacturer Part Number: 0402WGF0000TCE; Power: 1/16W; ComponentLink1Description: Supplier link; ComponentLink1URL: http://www.szlcsc.com/product/details_17853.html; Package: 0402; Supplier: LC; SuppliersPartNumber: C17168; Resistance: 0Ω; Tolerance: 1%
U11 = W5500_[C32843]: Ethernet Controllers 2.97V ~ 3.63V 10/100 Base-T/TX PHY SPI LQFP-48_7x7x05P Ethernet ICs ROHS; Manufacturer: WIZNET; ComponentLink1Description: 供应商链接; ComponentLink1URL: http://www.szlcsc.com/product/details_33808.html; Package: LQFP-48_7x7x05P; Supplier: LC; SuppliersPartNumber: C32843; Manufacturer Part Number: W5500
Y3 = X322525MSB4SI: 25MHz SMD Crystal Resonator 20pF ±10ppm ±30ppm -40℃~+85℃ SMD3225-4P Crystals ROHS; Manufacturer 1: Yangxing Tech; Height: 0.8mm; SuppliersPartNumber: C13740; Supplier 1: LCSC; Supplier Part Number 1: C13740; Manufacturer Part Number 1: X322525MSB4SI; Manufacturer: Yangxing Tech; Manufacturer Part Number: X322525MSB4SI